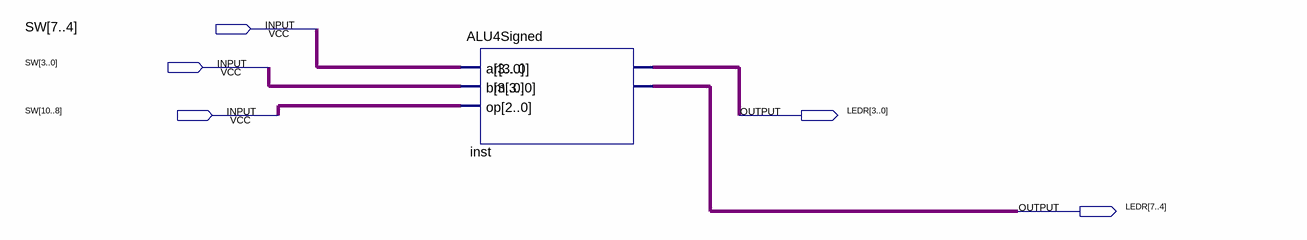
[diagram p0: schematic sheet]
// Quartus schematic ALUDemoSigned.bdf as structural Verilog: 1 symbols, 5 pins
module ALUDemoSigned (
  input  [10:0] SW,
  output [7:0] LEDR
);

  ALU4Signed inst (.a(SW[7:4]), .b(SW[3:0]), .op(SW[10:8]), .r(LEDR[3:0]), .m(LEDR[7:4]));
endmodule
